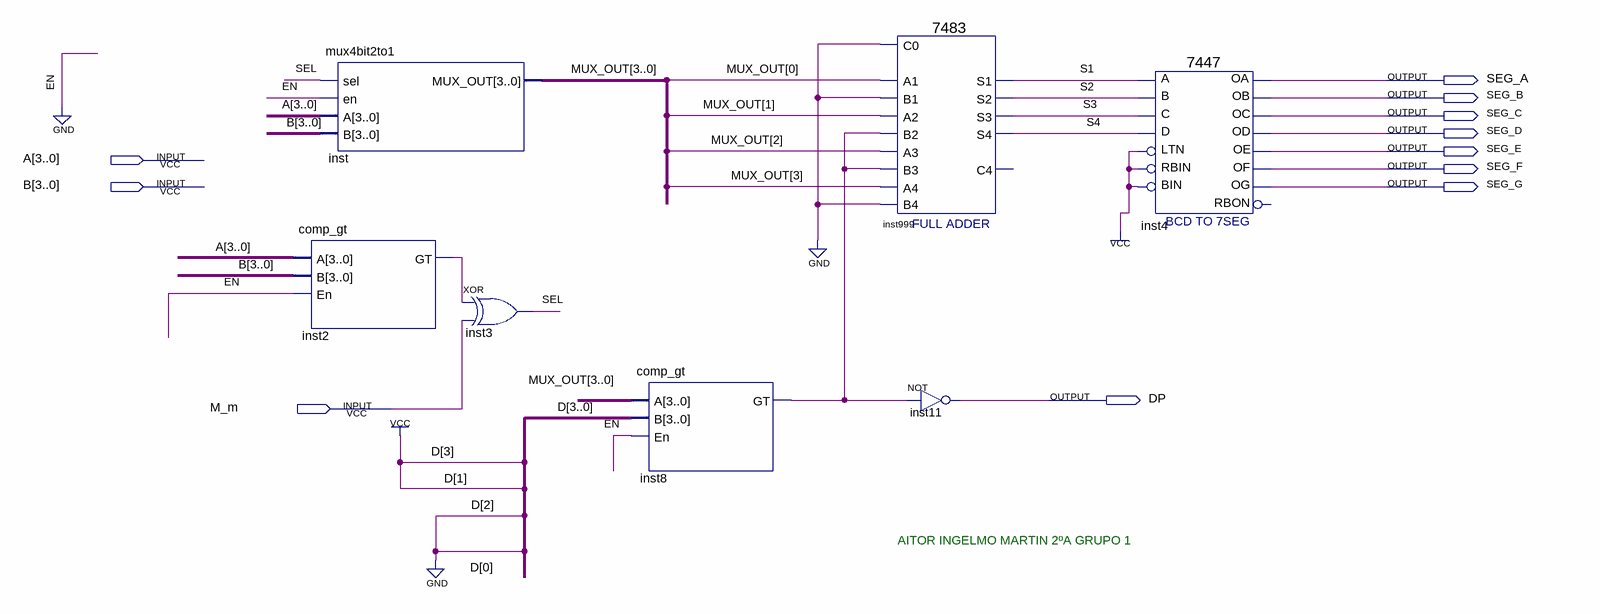
[diagram p0: schematic sheet]
// Quartus schematic PR2_GRPA1_P10.bdf as structural Verilog: 7 symbols, 11 pins
module PR2_GRPA1_P10 (
  input  [3:0] A,
  input  [3:0] B,
  input  M_m,
  output SEG_A,
  output SEG_B,
  output SEG_C,
  output SEG_D,
  output SEG_E,
  output SEG_F,
  output SEG_G,
  output DP
);

  wire inst2_gt, inst8_gt, S1, S2, S3, S4, SEL;
  wire [3:0] MUX_OUT;

  mux4bit2to1 inst (.sel(SEL), .en(1'b0), .A(A), .B(B), .MUX_OUT(MUX_OUT));
  comp_gt inst2 (.A(A), .B(B), .En(1'b0), .GT(inst2_gt));
  xor inst3 (SEL, inst2_gt, M_m);
  comp_gt inst8 (.A(MUX_OUT), .B(4'b1010), .En(1'b0), .GT(inst8_gt));
  \7483  inst999 (
    .B4(1'b0), .C0(1'b0), .A1(MUX_OUT[0]), .A2(MUX_OUT[1]), .B1(1'b0), .B2(inst8_gt), .A3(MUX_OUT[2]),
    .B3(inst8_gt), .A4(MUX_OUT[3]), .S3(S3), .S4(S4), .S2(S2), .S1(S1));  // open: C4
  not inst11 (DP, inst8_gt);
  \7447  inst4 (
    .LTN(1'b1), .B(S2), .C(S3), .D(S4), .RBIN(1'b1), .BIN(1'b1), .A(S1), .OB(SEG_B), .OC(SEG_C), .OE(SEG_E),
    .OD(SEG_D), .OF(SEG_F), .OG(SEG_G), .OA(SEG_A));  // open: RBON

  // Notes on the sheet:
  //   AITOR INGELMO MARTIN 2ºA GRUPO 1
endmodule
